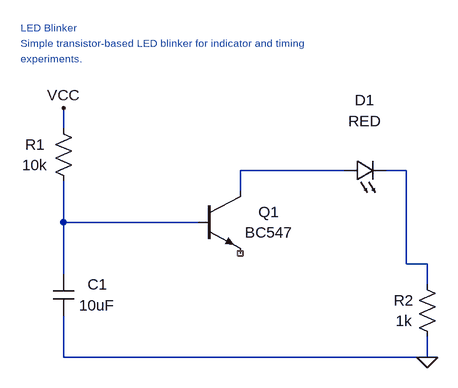
[diagram p0: schematic led_blinker.asc]
led_blinker.asc, the LTspice schematic file:
Version 4
SHEET 1 720 608
SYMBOL cap 224 464 R0
WINDOW 0 68 16 Center 2
WINDOW 3 68 48 Center 2
SYMATTR InstName C1
SYMATTR Value 10uF
SYMBOL led 672 320 R270
WINDOW 0 124 32 VCenter 2
WINDOW 3 92 32 VCenter 2
SYMATTR InstName D1
SYMATTR Value RED
SYMBOL npn 448 336 R0
WINDOW 0 108 32 Center 2
WINDOW 3 108 64 Center 2
SYMATTR InstName Q1
SYMATTR Value BC547
SYMBOL res 224 224 R0
WINDOW 0 -28 40 Center 2
WINDOW 3 -28 72 Center 2
SYMATTR InstName R1
SYMATTR Value 10k
SYMBOL res 784 464 R0
WINDOW 0 -20 40 Center 2
WINDOW 3 -20 72 Center 2
SYMATTR InstName R2
SYMATTR Value 1k
WIRE 240 208 240 240
WIRE 240 320 240 384
WIRE 240 384 240 464
WIRE 240 384 448 384
WIRE 240 528 240 592
WIRE 240 592 800 592
WIRE 512 304 512 336
WIRE 512 304 672 304
WIRE 736 304 768 304
WIRE 768 304 768 448
WIRE 768 448 800 448
WIRE 800 448 800 480
WIRE 800 560 800 592
FLAG 800 592 0
FLAG 240 208 VCC
TEXT 174 84 Left 1 ;LED Blinker
TEXT 174 108 Left 1 ;Simple transistor-based LED blinker for indicator and timing
TEXT 174 132 Left 1 ;experiments.

The netlist it stands for:
* led_blinker.asc
C1 N001 0 10uF
D1 N002 N003 RED
Q1 N002 N001 NC_01 0 BC547
R1 VCC N001 10k
R2 N003 0 1k
.model D D
.lib standard.dio
.model NPN NPN
.model PNP PNP
.lib standard.bjt
* LED Blinker
* Simple transistor-based LED blinker for indicator and timing
* experiments.
.backanno
.end